# EAGLE schematic ch340g-uart (EAGLE 8.6.1)
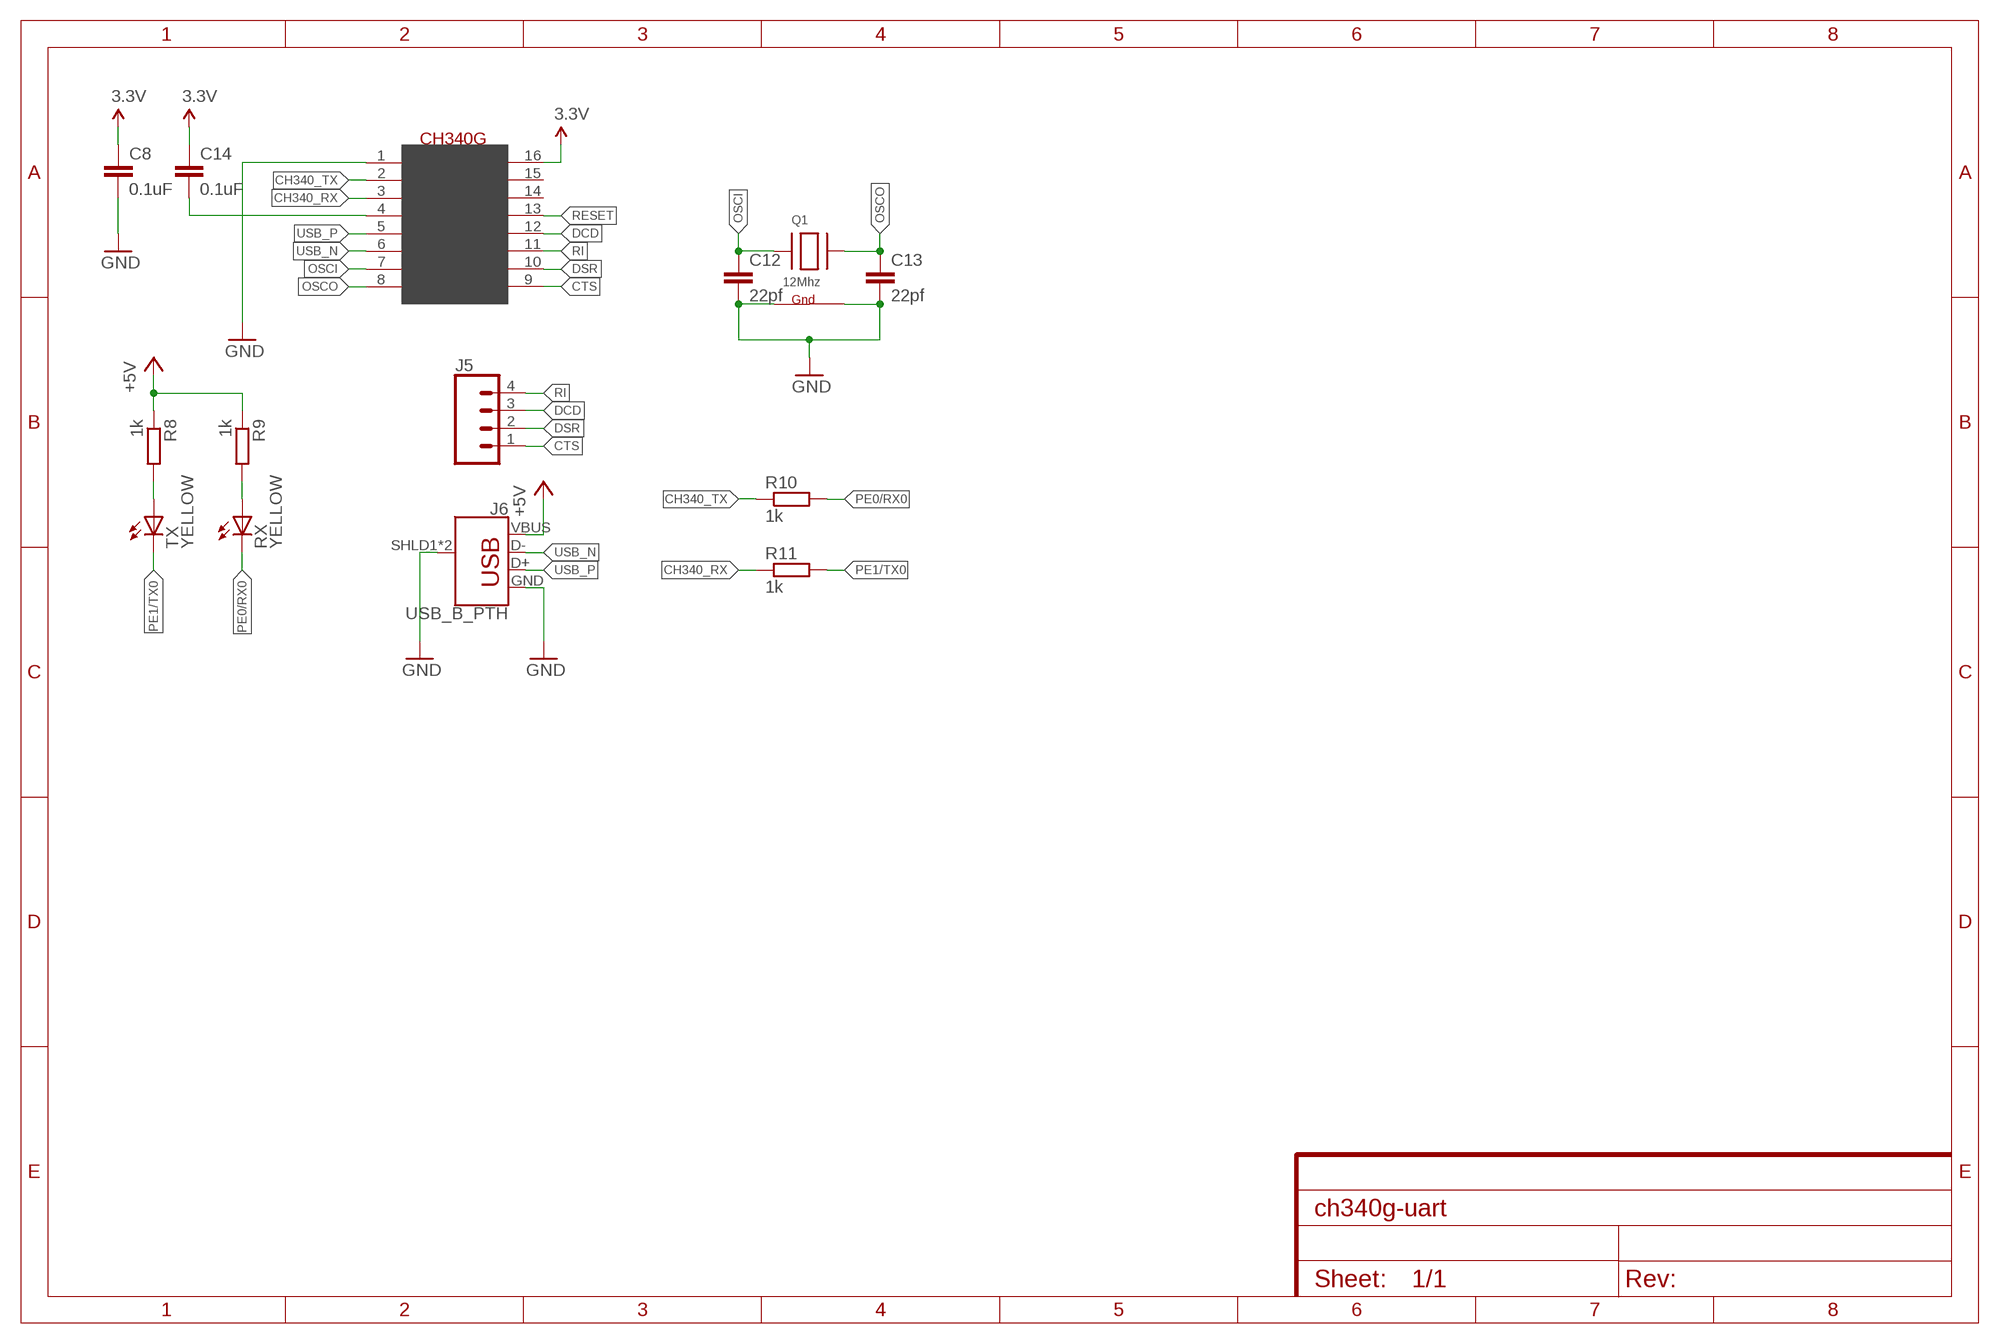
[diagram p0: schematic, sheet 1]

## Parts
C8  0.1uF  C-EUC1206  [C1206]
C12  22pf  C-EUC1206  [C1206]
C13  22pf  C-EUC1206  [C1206]
C14  0.1uF  C-EUC1206  [C1206]
IC3  CH340G  [SOIC16]
J5  CONN_04  [1X04]
J6  USB_B_PTH  [USB-B-PTH]
Q1  12Mhz  XTAL-4-3225  [NX3225]
R8  1k  R-EU_R1206  [R1206]
R9  1k  R-EU_R1206  [R1206]
R10  1k  R-EU_R1206  [R1206]
R11  1k  R-EU_R1206  [R1206]
RX  YELLOW  LEDCHIP-LED0805  [CHIP-LED0805]
TX  YELLOW  LEDCHIP-LED0805  [CHIP-LED0805]

## Nets
3.3V: C8.1 C14.1 IC3.16(VCC)
+5V [power usb]: J6.VBUS R8.1 R9.1
CH340_RX: IC3.3(RX) R11.1
CH340_TX: IC3.2(TX) R10.1
CTS: IC3.9(CTS) J5.1
DCD: IC3.12(DCD) J5.3
DSR: IC3.10(DSR) J5.2
GND [gnd]: C8.2 C12.2 C13.2 IC3.1(GND) J6.GND J6.SHLD1(SHIELD) J6.SHLD2(SHIELD) Q1.2(G2) Q1.4(G1)
N$3: C14.2 IC3.4(V3)
N$5: R8.2 TX.A
N$6: R9.2 RX.A
OSCI: C12.1 IC3.7(XI) Q1.1(X1)
OSCO: C13.1 IC3.8(XO) Q1.3(X2)
PE0/RX0: R10.2 RX.C
PE1/TX0: R11.2 TX.C
RESET: IC3.13(DTR)
RI: IC3.11(RI) J5.4
USB_N: IC3.6(D-) J6.D-
USB_P: IC3.5(D+) J6.D+
Unconnected: IC3.14(RTS) IC3.15(RS232)

## Library data of the parts
C8 C14 = rcl:C-EU: CAPACITOR, European symbol; SPICEPREFIX: C
C12 C13 = rcl:C-EU: CAPACITOR, European symbol
IC3 = CH340G-USB-SERIAL:CH340G
J5 = SparkFun-Connectors:CONN_04: Multi connection point. Often used as Generic Header-pin footprint for 0.1 inch spaced/style header connections On any of the 0.1 inch spaced packages, you can populate with these: Break Away Headers - Straight <https://www.sparkfun.com/products/116> (PRT-00116) Break Away Male Headers - Right Angle <https://www.sparkfun.com/products/553> (PRT-00553) Female Headers <https://www.sparkfun.com/products/115> (PRT-00115) Break Away Headers - Machine Pin <https://www.sparkfun.com/products/117> (PRT-00117) Break Away Female Headers - Swiss Machine Pin <https://www.sparkfun.com/products/743> (PRT-00743) For SCREWTERMINALS and SPRING TERMINALS visit here: Screw Terimnals on SparkFun.com <https://www.sparkfun.com/search/results?term=Screw+Terminals> (5mm/3.5mm/2.54mm spacing) This device is also useful as a general connection point to wire up your design to another part of your project. Our various solder wires solder well into these plated through hole pads. Hook-Up Wire - Assortment (Stranded, 22 AWG) <https://www.sparkfun.com/products/11375> (PRT-11375) Hook-Up Wire - Assortment (Solid Core, 22 AWG) <https://www.sparkfun.com/products/11367> (PRT-11367) View the entire wire category on our website here <https://www.sparkfun.com/categories/141> Special notes: Molex polarized connector foot print use with SKU : PRT-08231 with associated crimp pins and housings. 1MM SMD Version SKU: PRT-10208; PROD_ID: CONN-09696
J6 = SparkFun-Connectors:USB_B: USB Type B Connector SparkFun Products: SparkFun Stepoko <https://www.sparkfun.com/products/13899> PTH; PROD_ID: CONN-08278; SF_ID: PRT-00139
Q1 = adafruit:XTAL-4: Classic 4-pin 3.2 x 2.5mm crystal
R8-R11 = rcl:R-EU_: RESISTOR, European symbol; SPICEPREFIX: R
RX TX = led:LED: LED OSRAM: - CHIPLED LG R971, LG N971, LY N971, LG Q971, LY Q971, LO R971, LY R971 LH N974, LH R974 LS Q976, LO Q976, LY Q976 LO Q996 - Hyper CHIPLED LW Q18S LB Q993, LB Q99A, LB R99A - SideLED LS A670, LO A670, LY A670, LG A670, LP A670 LB A673, LV A673, LT A673, LW A673 LH A674 LY A675 LS A676, LA A676, LO A676, LY A676, LW A676 LS A679, LY A679, LG A679 - Hyper Micro SIDELED® LS Y876, LA Y876, LO Y876, LY Y876 LT Y87S - SmartLED LW L88C, LW L88S LB L89C, LB L89S, LG L890 LS L89K, LO L89K, LY L89K LS L896, LA L896, LO L896, LY L896 - TOPLED LS T670, LO T670, LY T670, LG T670, LP T670 LSG T670, LSP T670, LSY T670, LOP T670, LYG T670 LG T671, LOG T671, LSG T671 LB T673, LV T673, LT T673, LW T673 LH T674 LS T676, LA T676, LO T676, LY T676, LB T676, LH T676, LSB T676, LW T676 LB T67C, LV T67C, LT T67C, LS T67K, LO T67K, LY T67K, LW E67C LS E67B, LA E67B, LO E67B, LY E67B, LB E67C, LV E67C, LT E67C LW T67C LS T679, LY T679, LG T679 LS T770, LO T770, LY T770, LG T770, LP T770 LB T773, LV T773, LT T773, LW T773 LH T774 LS E675, LA E675, LY E675, LS T675 LS T776, LA T776, LO T776, LY T776, LB T776 LHGB T686 LT T68C, LB T68C - Hyper Mini TOPLED® LB M676 - Mini TOPLED Santana® LG M470 LS M47K, LO M47K, LY M47K Source: http://www.osram.convergy.de LUXEON: - LUMILED® LXK2-PW12-R00, LXK2-PW12-S00, LXK2-PW14-U00, LXK2-PW14-V00 LXK2-PM12-R00, LXK2-PM12-S00, LXK2-PM14-U00 LXK2-PE12-Q00, LXK2-PE12-R00, LXK2-PE12-S00, LXK2-PE14-T00, LXK2-PE14-U00 LXK2-PB12-K00, LXK2-PB12-L00, LXK2-PB12-M00, LXK2-PB14-N00, LXK2-PB14-P00, LXK2-PB14-Q00 LXK2-PR12-L00, LXK2-PR12-M00, LXK2-PR14-Q00, LXK2-PR14-R00 LXK2-PD12-Q00, LXK2-PD12-R00, LXK2-PD12-S00 LXK2-PH12-R00, LXK2-PH12-S00 LXK2-PL12-P00, LXK2-PL12-Q00, LXK2-PL12-R00 Source: www.luxeon.com KINGBRIGHT: KA-3528ASYC Source: www.kingbright.com

## Net classes
2 gnd: width 0.305 mm, drill 0.406 mm, clearance 0.203 mm
3 power usb: width 0.508 mm, drill 0.406 mm, clearance 0.203 mm